# EAGLE design breakout-18 (EAGLE 6.5.0)
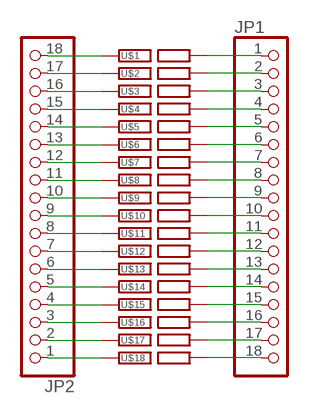
[diagram p0: schematic, sheet 1]

## Parts
JP1  PINHD-1X18  [1X18]
JP2  PINHD-1X18  [1X18]
U$1  RAILSEP  [RAIL]
U$2  RAILSEP  [RAIL]
U$3  RAILSEP  [RAIL]
U$4  RAILSEP  [RAIL]
U$5  RAILSEP  [RAIL]
U$6  RAILSEP  [RAIL]
U$7  RAILSEP  [RAIL]
U$8  RAILSEP  [RAIL]
U$9  RAILSEP  [RAIL]
U$10  RAILSEP  [RAIL]
U$11  RAILSEP  [RAIL]
U$12  RAILSEP  [RAIL]
U$13  RAILSEP  [RAIL]
U$14  RAILSEP  [RAIL]
U$15  RAILSEP  [RAIL]
U$16  RAILSEP  [RAIL]
U$17  RAILSEP  [RAIL]
U$18  RAILSEP  [RAIL]

## Nets
N$1: JP2.18 U$1.P$L(L)
N$2: JP2.17 U$2.P$L(L)
N$3: JP2.16 U$3.P$L(L)
N$4: JP2.15 U$4.P$L(L)
N$5: JP2.14 U$5.P$L(L)
N$6: JP2.13 U$6.P$L(L)
N$7: JP2.12 U$7.P$L(L)
N$8: JP2.11 U$8.P$L(L)
N$9: JP2.10 U$9.P$L(L)
N$10: JP2.9 U$10.P$L(L)
N$12: JP2.8 U$11.P$L(L)
N$13: JP2.7 U$12.P$L(L)
N$14: JP2.6 U$13.P$L(L)
N$15: JP2.5 U$14.P$L(L)
N$16: JP2.4 U$15.P$L(L)
N$17: JP2.3 U$16.P$L(L)
N$18: JP2.2 U$17.P$L(L)
N$19: JP2.1 U$18.P$L(L)
N$31: JP1.1 U$1.P$R(R)
N$32: JP1.2 U$2.P$R(R)
N$33: JP1.3 U$3.P$R(R)
N$34: JP1.4 U$4.P$R(R)
N$35: JP1.5 U$5.P$R(R)
N$36: JP1.6 U$6.P$R(R)
N$37: JP1.7 U$7.P$R(R)
N$38: JP1.8 U$8.P$R(R)
N$39: JP1.9 U$9.P$R(R)
N$40: JP1.10 U$10.P$R(R)
N$41: JP1.11 U$11.P$R(R)
N$42: JP1.12 U$12.P$R(R)
N$43: JP1.13 U$13.P$R(R)
N$44: JP1.14 U$14.P$R(R)
N$45: JP1.15 U$15.P$R(R)
N$46: JP1.16 U$16.P$R(R)
N$47: JP1.17 U$17.P$R(R)
N$48: JP1.18 U$18.P$R(R)

## Library data of the parts
JP1 JP2 = pinhead:PINHD-1X18: PIN HEADER
U$1-U$18 = butter:RAILSEP

## Board
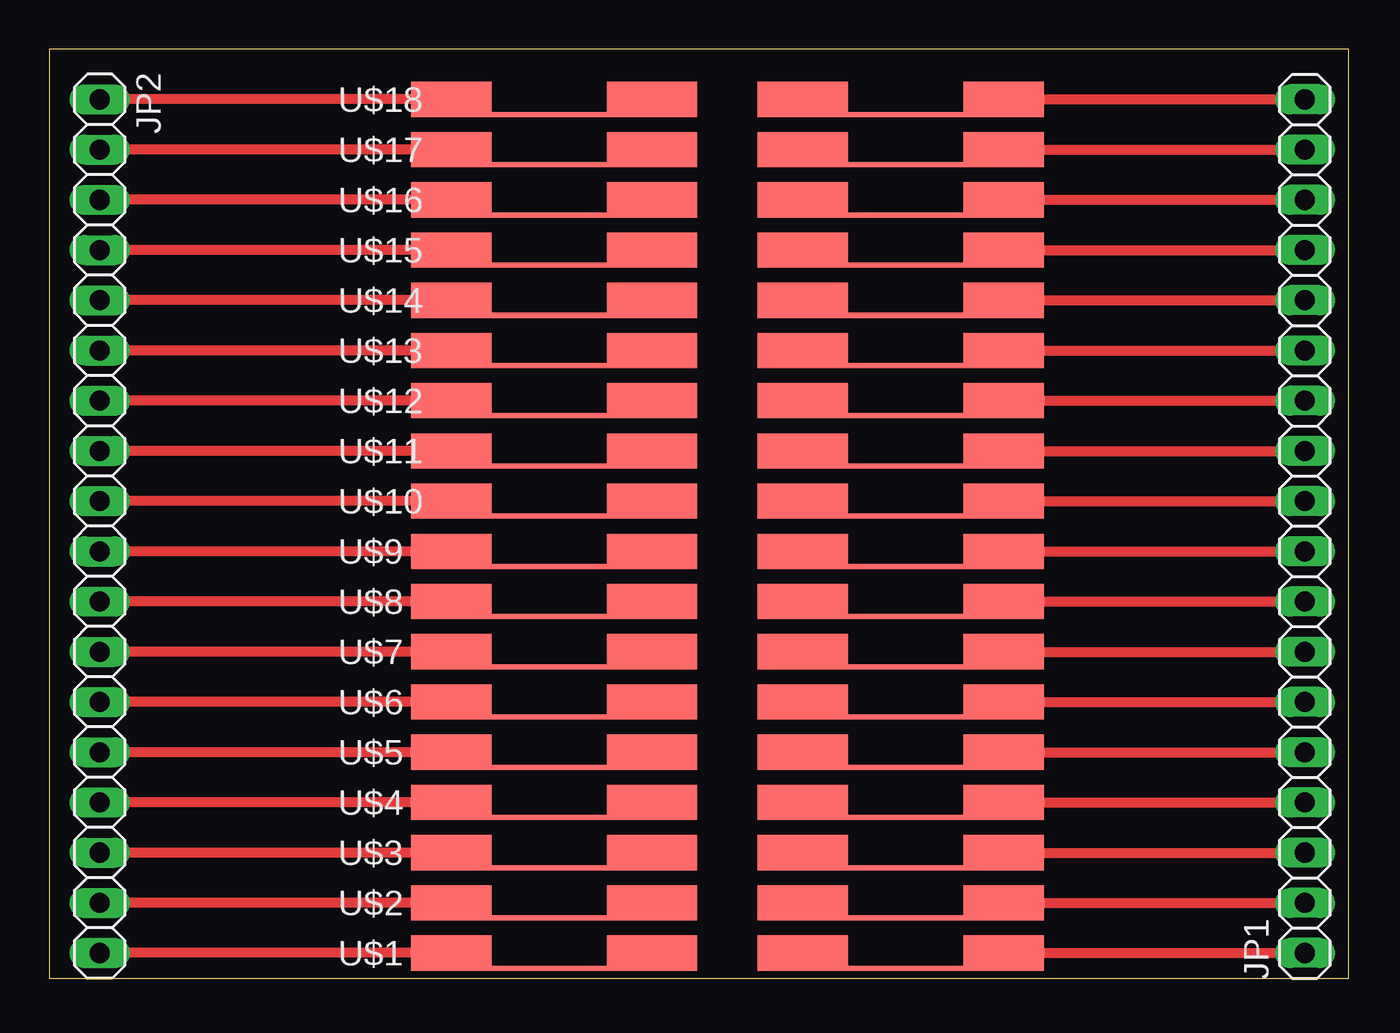
[diagram p1: board, top side]

Size 65.71 x 46.98 mm. Coordinates in mm from the lower left corner, seen from the top.
Outline: 0,0 65.71,0 65.71,46.98 0,46.98 0,0
Copper layers (1*16): Top 0.035mm / dielectric 1.5mm / Bottom 0.035mm
Design rules "default *": minimum track width 20mil, minimum drill 24mil, track to track 8mil, track to pad 8mil, pad to pad 8mil, via to via 8mil, smd to smd 8mil, copper to edge 40mil, drill to drill 8mil, minimum pad ring 10mil, minimum via ring 8mil, stop-mask expansion 4mil, vias tented up to drill 0mil, thermal gap 10mil

### Footprints (pad centres in the part's own frame; a part is rotated, then mirrored left to right if it is on the bottom)
1X18 = drill 1.016 long: 1 -21.59,0; 2 -19.05,0; 3 -16.51,0; 4 -13.97,0; 5 -11.43,0; 6 -8.89,0; 7 -6.35,0; 8 -3.81,0; 9 -1.27,0; 10 1.27,0; 11 3.81,0; 12 6.35,0; 13 8.89,0; 14 11.43,0; 15 13.97,0; 16 16.51,0; 17 19.05,0; 18 21.59,0
RAIL = smd 14.478 x 0.254: P$1 -8.763,-0.762; P$2 8.763,-0.762 | smd 4.572 x 1.778: P$3 -3.81,0; P$4 3.81,0 | smd 4.064 x 1.778: P$L -13.97,0; P$R 13.97,0

### Placement (x,y rotation side)
JP1  63.5,22.86 90 top
JP2  2.54,22.86 270 top
U$1  34.29,1.27 0 top
U$2  34.29,3.81 0 top
U$3  34.29,6.35 0 top
U$4  34.29,8.89 0 top
U$5  34.29,11.43 0 top
U$6  34.29,13.97 0 top
U$7  34.29,16.51 0 top
U$8  34.29,19.05 0 top
U$9  34.29,21.59 0 top
U$10  34.29,24.13 0 top
U$11  34.29,26.67 0 top
U$12  34.29,29.21 0 top
U$13  34.29,31.75 0 top
U$14  34.29,34.29 0 top
U$15  34.29,36.83 0 top
U$16  34.29,39.37 0 top
U$17  34.29,41.91 0 top
U$18  34.29,44.45 0 top

### Tracks (layer width: path | path; a pad name or v marks a point on that pad's centre or on a via)
N$1
  Top 0.508: U$1.P$L JP2.18
N$2
  Top 0.508: U$2.P$L JP2.17
N$3
  Top 0.508: U$3.P$L JP2.16
N$4
  Top 0.508: U$4.P$L JP2.15
N$5
  Top 0.508: U$5.P$L JP2.14
N$6
  Top 0.508: U$6.P$L JP2.13
N$7
  Top 0.508: U$7.P$L JP2.12
N$8
  Top 0.508: U$8.P$L JP2.11
N$9
  Top 0.508: U$9.P$L JP2.10
N$10
  Top 0.508: U$10.P$L JP2.9
N$12
  Top 0.508: U$11.P$L JP2.8
N$13
  Top 0.508: U$12.P$L JP2.7
N$14
  Top 0.508: U$13.P$L JP2.6
N$15
  Top 0.508: U$14.P$L JP2.5
N$16
  Top 0.508: U$15.P$L JP2.4
N$17
  Top 0.508: U$16.P$L JP2.3
N$18
  Top 0.508: U$17.P$L JP2.2
N$19
  Top 0.508: U$18.P$L JP2.1
N$31
  Top 0.508: U$1.P$R JP1.1
N$32
  Top 0.508: U$2.P$R JP1.2
N$33
  Top 0.508: U$3.P$R JP1.3
N$34
  Top 0.508: U$4.P$R JP1.4
N$35
  Top 0.508: U$5.P$R JP1.5
N$36
  Top 0.508: U$6.P$R JP1.6
N$37
  Top 0.508: U$7.P$R JP1.7
N$38
  Top 0.508: U$8.P$R JP1.8
N$39
  Top 0.508: U$9.P$R JP1.9
N$40
  Top 0.508: U$10.P$R JP1.10
N$41
  Top 0.508: U$11.P$R JP1.11
N$42
  Top 0.508: U$12.P$R JP1.12
N$43
  Top 0.508: U$13.P$R JP1.13
N$44
  Top 0.508: U$14.P$R JP1.14
N$45
  Top 0.508: U$15.P$R JP1.15
N$46
  Top 0.508: U$16.P$R JP1.16
N$47
  Top 0.508: U$17.P$R JP1.17
N$48
  Top 0.508: U$18.P$R JP1.18